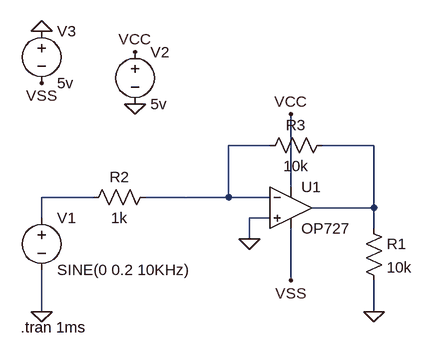
[diagram p0: schematic 6532142421-PB2.asc]
6532142421-PB2.asc, the LTspice schematic file:
Version 4
SHEET 1 880 680
WIRE 16 32 -48 32
WIRE 176 32 96 32
WIRE 48 96 48 -16
WIRE -256 112 -336 112
WIRE -48 112 -48 32
WIRE -48 112 -176 112
WIRE 16 112 -48 112
WIRE 176 128 176 32
WIRE 176 128 80 128
WIRE -336 144 -336 112
WIRE 16 144 -16 144
WIRE 176 160 176 128
WIRE -16 176 -16 144
WIRE 48 240 48 160
WIRE -336 288 -336 224
WIRE 176 288 176 240
FLAG 176 288 0
FLAG -336 288 0
FLAG 48 240 VSS
FLAG 48 -16 VCC
FLAG -192 -112 VCC
FLAG -192 -32 0
FLAG -336 -144 0
FLAG -336 -64 VSS
FLAG -16 176 0
SYMBOL res 160 144 R0
SYMATTR InstName R1
SYMATTR Value 10k
SYMBOL voltage -336 128 R0
WINDOW 123 0 0 Left 0
WINDOW 39 0 0 Left 0
SYMATTR InstName V1
SYMATTR Value SINE(0 0.2 10KHz)
SYMBOL voltage -192 -128 R0
WINDOW 123 0 0 Left 0
WINDOW 39 0 0 Left 0
SYMATTR InstName V2
SYMATTR Value 5v
SYMBOL OP727 48 64 R0
SYMATTR InstName U1
SYMBOL voltage -336 -160 R0
SYMATTR InstName V3
SYMATTR Value 5v
SYMBOL res -160 96 R90
WINDOW 0 0 56 VBottom 2
WINDOW 3 32 56 VTop 2
SYMATTR InstName R2
SYMATTR Value 1k
SYMBOL res 112 16 R90
WINDOW 0 0 56 VBottom 2
WINDOW 3 32 56 VTop 2
SYMATTR InstName R3
SYMATTR Value 10k
TEXT -368 312 Left 2 !.tran 1ms
LINE Normal -112 112 -116 112 2

The netlist it stands for:
* 6532142421-PB2.asc
R1 N002 0 10k
V1 N003 0 SINE(0 0.2 10KHz)
V2 VCC 0 5v
* U1: OP727 (symbol OP727 not available, pins judged from their places): In+=0 In-=N001 V+=VCC V-=VSS OUT=N002
V3 0 VSS 5v
R2 N001 N003 1k
R3 N002 N001 10k
.tran 1ms
.backanno
.end